# EAGLE design rpi2_relay2 (EAGLE 7.7.0)
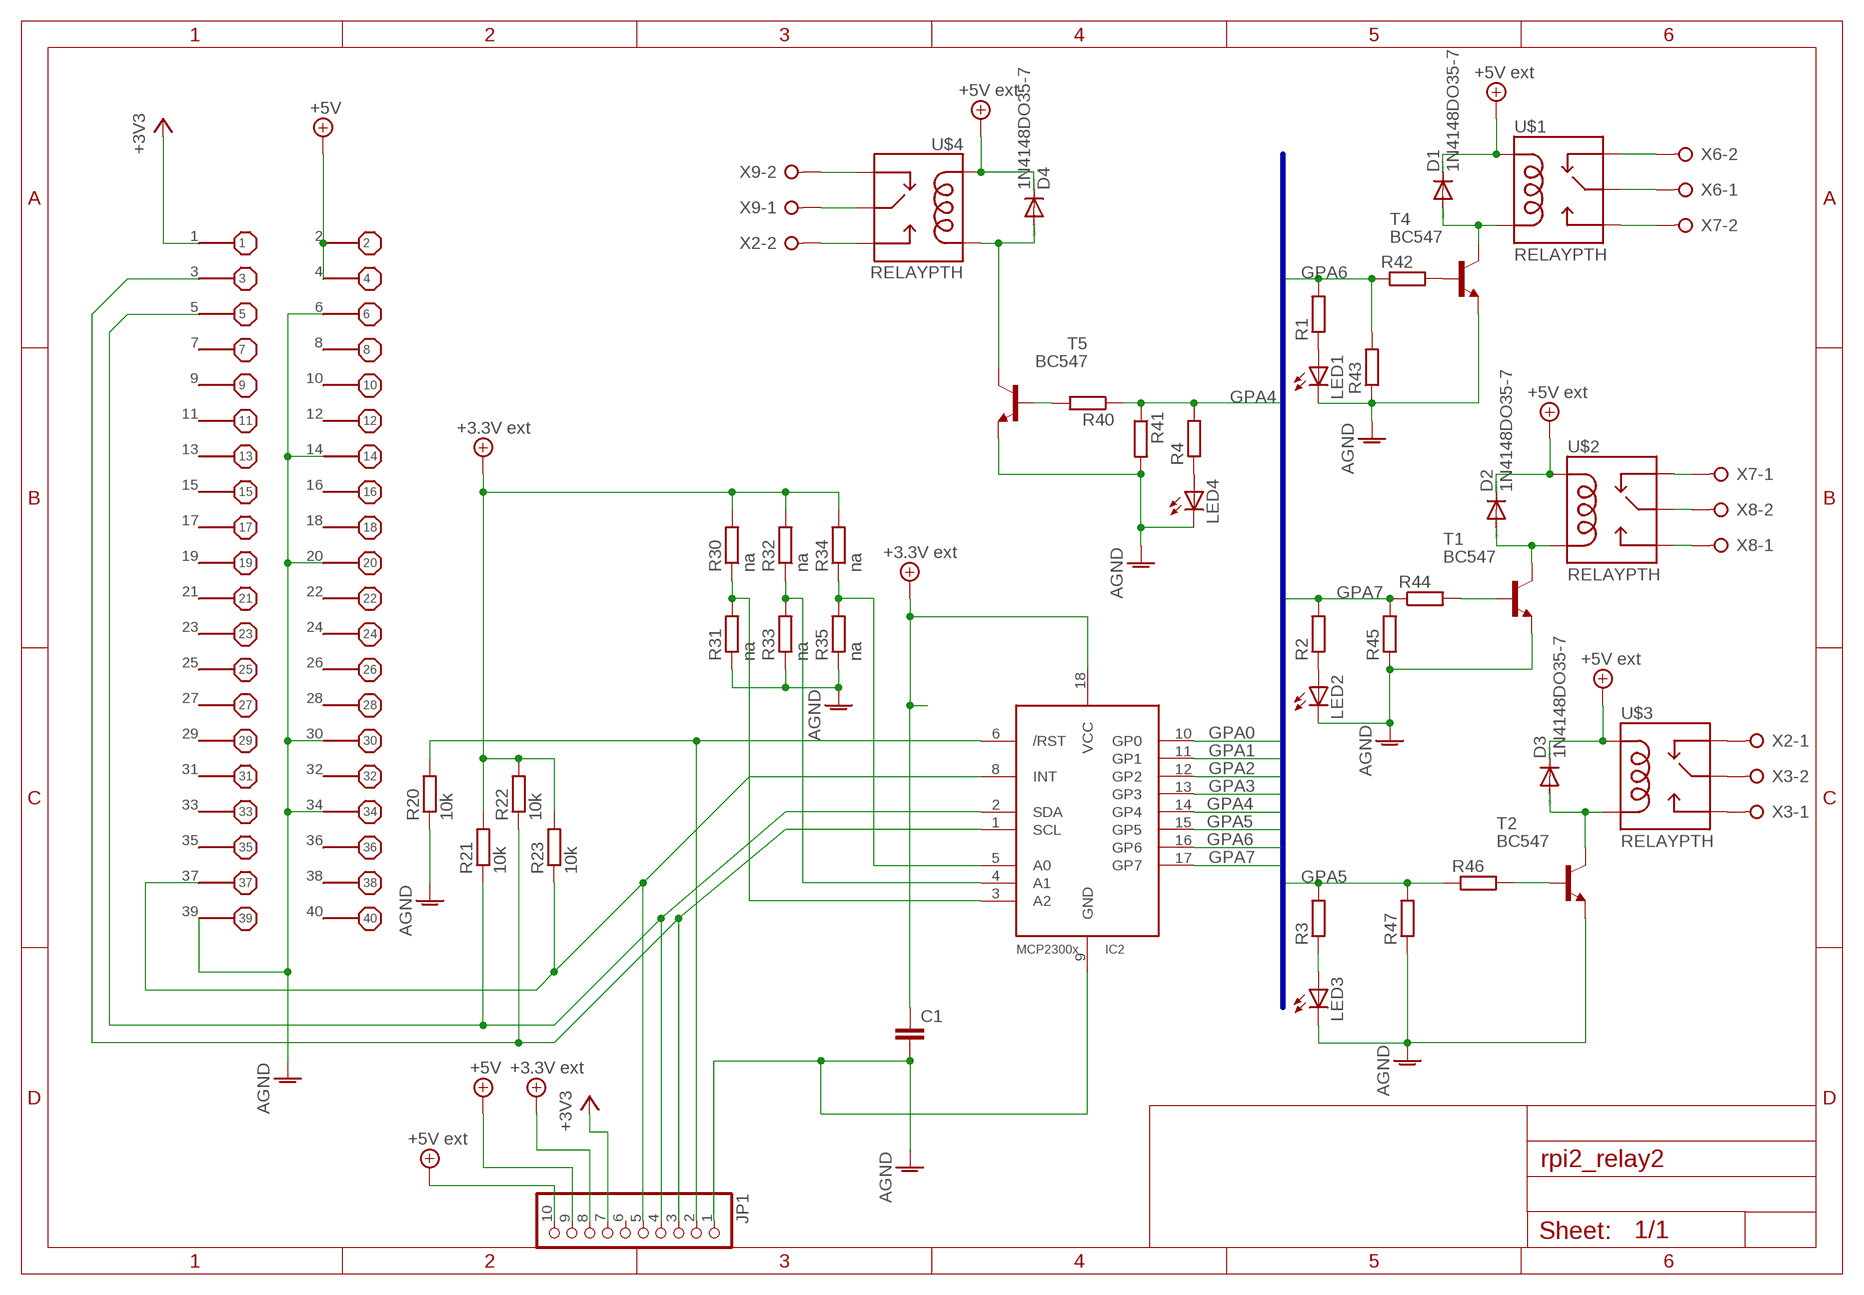
[diagram p0: schematic, sheet 1]

## Parts
C1  C-EUC1210  [C1210]
D1  1N4148DO35-7  [DO35-7]
D2  1N4148DO35-7  [DO35-7]
D3  1N4148DO35-7  [DO35-7]
D4  1N4148DO35-7  [DO35-7]
IC2  MCP23008/P  [DIL18]
JP1  PINHD-1X10  [1X10]
LED1  LEDCHIP-LED0805  [CHIP-LED0805]
LED2  LEDCHIP-LED0805  [CHIP-LED0805]
LED3  LEDCHIP-LED0805  [CHIP-LED0805]
LED4  LEDCHIP-LED0805  [CHIP-LED0805]
R1  R-EU_R0805  [R0805]
R2  R-EU_R0805  [R0805]
R3  R-EU_R0805  [R0805]
R4  R-EU_R0805  [R0805]
R20  10k  R-EU_R0805  [R0805]
R21  10k  R-EU_R0805  [R0805]
R22  10k  R-EU_R0805  [R0805]
R23  10k  R-EU_R0805  [R0805]
R30  na  R-EU_R0805  [R0805]
R31  na  R-EU_R0805  [R0805]
R32  na  R-EU_R0805  [R0805]
R33  na  R-EU_R0805  [R0805]
R34  na  R-EU_R0805  [R0805]
R35  na  R-EU_R0805  [R0805]
R40  R-EU_R0805  [R0805]
R41  R-EU_R0805  [R0805]
R42  R-EU_R0805  [R0805]
R43  R-EU_R0805  [R0805]
R44  R-EU_R0805  [R0805]
R45  R-EU_R0805  [R0805]
R46  R-EU_R0805  [R0805]
R47  R-EU_R0805  [R0805]
T1  BC547  [TO92]
T2  BC547  [TO92]
T4  BC547  [TO92]
T5  BC547  [TO92]
U$1  RELAYPTH  [SRD-05VDC-SL-C]
U$2  RELAYPTH  [SRD-05VDC-SL-C]
U$3  RELAYPTH  [SRD-05VDC-SL-C]
U$4  RELAYPTH  [SRD-05VDC-SL-C]
X1  B+_GPIO  [B+_GPIO]
X2  W237-02P  [W237-132]
X3  W237-02P  [W237-132]
X6  W237-02P  [W237-132]
X7  W237-02P  [W237-132]
X8  W237-02P  [W237-132]
X9  W237-02P  [W237-132]

## Nets
3.3VEXT: C1.1 IC2.18(VCC) JP1.8 R21.2 R22.2 R23.2 R30.2 R32.2 R34.2 ; supply symbol labelled +3.3V ext
+3V3: JP1.7 X1.1
+5V: JP1.9 X1.2 X1.4
+5V/1: D1.C D2.C D3.C D4.C JP1.10 U$1.COIL1 U$2.COIL1 U$3.COIL1 U$4.COIL1 ; supply symbol labelled +5V ext
AGND: C1.2 IC2.9(GND) JP1.1 LED1.C LED2.C LED3.C LED4.C R20.1 R31.1 R33.1 R35.1 R41.2 R43.1 R45.1 R47.1 T1.1(E) T2.1(E) T4.1(E) T5.1(E) X1.6 X1.14 X1.20 X1.30 X1.34 X1.39
GPA0: IC2.10(GP0)
GPA1: IC2.11(GP1)
GPA2: IC2.12(GP2)
GPA3: IC2.13(GP3)
GPA4: IC2.14(GP4) R4.2 R40.1 R41.1
GPA5: IC2.15(GP5) R3.2 R46.1 R47.2
GPA6: IC2.16(GP6) R1.2 R42.1 R43.2
GPA7: IC2.17(GP7) R2.2 R44.1 R45.2
N$1: R46.2 T2.2(B)
N$2: D1.A T4.3(C) U$1.COIL0
N$3: IC2.1(SCL) JP1.3 R22.1 X1.3
N$4: IC2.2(SDA) JP1.4 R21.1 X1.5
N$5: LED1.A R1.1
N$6: IC2.8(INT) JP1.5 R23.1 X1.37
N$7: IC2.6(/RST) JP1.2 R20.2
N$8: R44.2 T1.2(B)
N$9: U$1.SWCOMMON X6.1
N$10: U$1.SWCLOSED(SWCLOSE) X6.2
N$11: U$1.SWOPEN X7.2
N$12: D2.A T1.3(C) U$2.COIL0
N$13: LED2.A R2.1
N$14: U$2.SWCLOSED(SWCLOSE) X7.1
N$15: U$2.SWOPEN X8.1
N$16: U$2.SWCOMMON X8.2
N$17: D3.A T2.3(C) U$3.COIL0
N$18: LED3.A R3.1
N$19: U$3.SWCOMMON X3.2
N$20: U$3.SWOPEN X3.1
N$21: U$3.SWCLOSED(SWCLOSE) X2.1
N$22: D4.A T5.3(C) U$4.COIL0
N$23: IC2.3(A2) R30.1 R31.2
N$24: U$4.SWCOMMON X9.1
N$25: U$4.SWOPEN X2.2
N$26: U$4.SWCLOSED(SWCLOSE) X9.2
N$27: R40.2 T5.2(B)
N$28: R42.2 T4.2(B)
N$29: IC2.4(A1) R32.1 R33.2
N$30: IC2.5(A0) R34.1 R35.2
N$31: LED4.A R4.1
Unconnected: JP1.6 X1.7 X1.8 X1.9 X1.10 X1.11 X1.12 X1.13 X1.15 X1.16 X1.17 X1.18 X1.19 X1.21 X1.22 X1.23 X1.24 X1.25 X1.26 X1.27 X1.28 X1.29 X1.31 X1.32 X1.33 X1.35 X1.36 X1.38 X1.40

## Buses
GPA[0..7],GPB[0..7]

## Library data of the parts
C1 = rcl:C-EU: CAPACITOR, European symbol
D1-D4 = diode:1N4148: DIODE high speed (Philips)
IC2 = adafruit:MCP23008: MCP23008 Inexpensive i2c i/o expander - 8 general purpose i/o pins with optional pullups
JP1 = pinhead:PINHD-1X10: PIN HEADER
LED1-LED4 = led:LED: LED OSRAM: - CHIPLED LG R971, LG N971, LY N971, LG Q971, LY Q971, LO R971, LY R971 LH N974, LH R974 LS Q976, LO Q976, LY Q976 LO Q996 - Hyper CHIPLED LW Q18S LB Q993, LB Q99A, LB R99A - SideLED LS A670, LO A670, LY A670, LG A670, LP A670 LB A673, LV A673, LT A673, LW A673 LH A674 LY A675 LS A676, LA A676, LO A676, LY A676, LW A676 LS A679, LY A679, LG A679 - Hyper Micro SIDELED® LS Y876, LA Y876, LO Y876, LY Y876 LT Y87S - SmartLED LW L88C, LW L88S LB L89C, LB L89S, LG L890 LS L89K, LO L89K, LY L89K LS L896, LA L896, LO L896, LY L896 - TOPLED LS T670, LO T670, LY T670, LG T670, LP T670 LSG T670, LSP T670, LSY T670, LOP T670, LYG T670 LG T671, LOG T671, LSG T671 LB T673, LV T673, LT T673, LW T673 LH T674 LS T676, LA T676, LO T676, LY T676, LB T676, LH T676, LSB T676, LW T676 LB T67C, LV T67C, LT T67C, LS T67K, LO T67K, LY T67K, LW E67C LS E67B, LA E67B, LO E67B, LY E67B, LB E67C, LV E67C, LT E67C LW T67C LS T679, LY T679, LG T679 LS T770, LO T770, LY T770, LG T770, LP T770 LB T773, LV T773, LT T773, LW T773 LH T774 LS E675, LA E675, LY E675, LS T675 LS T776, LA T776, LO T776, LY T776, LB T776 LHGB T686 LT T68C, LB T68C - Hyper Mini TOPLED® LB M676 - Mini TOPLED Santana® LG M470 LS M47K, LO M47K, LY M47K Source: http://www.osram.convergy.de LUXEON: - LUMILED® LXK2-PW12-R00, LXK2-PW12-S00, LXK2-PW14-U00, LXK2-PW14-V00 LXK2-PM12-R00, LXK2-PM12-S00, LXK2-PM14-U00 LXK2-PE12-Q00, LXK2-PE12-R00, LXK2-PE12-S00, LXK2-PE14-T00, LXK2-PE14-U00 LXK2-PB12-K00, LXK2-PB12-L00, LXK2-PB12-M00, LXK2-PB14-N00, LXK2-PB14-P00, LXK2-PB14-Q00 LXK2-PR12-L00, LXK2-PR12-M00, LXK2-PR14-Q00, LXK2-PR14-R00 LXK2-PD12-Q00, LXK2-PD12-R00, LXK2-PD12-S00 LXK2-PH12-R00, LXK2-PH12-S00 LXK2-PL12-P00, LXK2-PL12-Q00, LXK2-PL12-R00 Source: www.luxeon.com KINGBRIGHT: KA-3528ASYC Source: www.kingbright.com
R1-R4 R20-R23 R30-R35 R40-R47 = rcl:R-EU_: RESISTOR, European symbol
T1 T2 T4 T5 = transistor:BC547: NPN TRANSISTOR
U$1-U$4 = SRD-05VDC-SL-C:RELAY: SPDT relay (COM-00101)
X1 = raspberry:B+_GPIO
X2 X3 X6-X9 = con-wago-508:W237-02P: WAGO SREW CLAMP; OC_FARNELL: unknown; OC_NEWARK: unknown

## Board
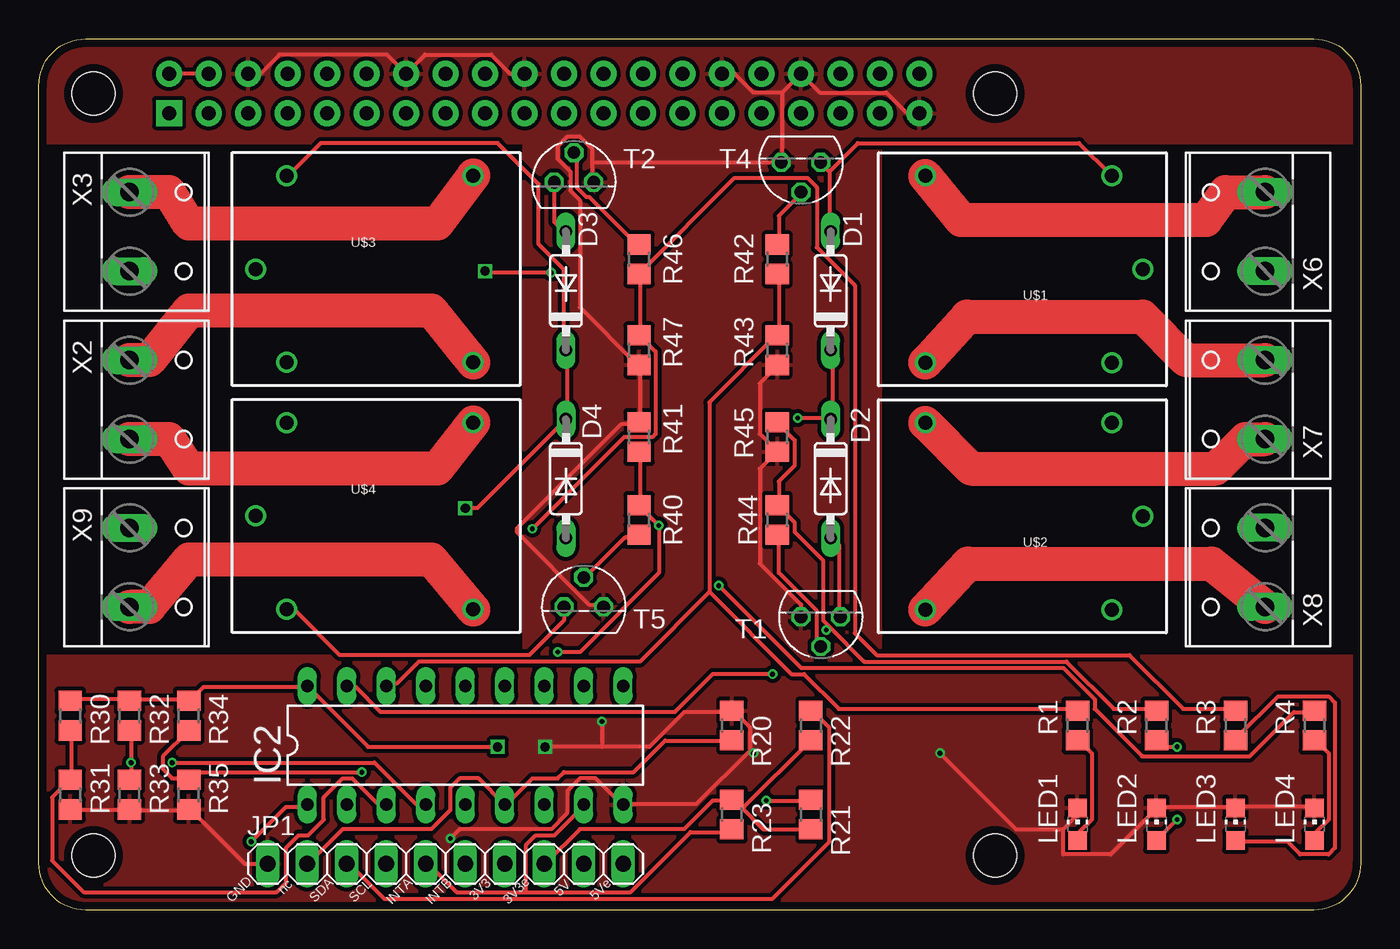
[diagram p1: board, top side]
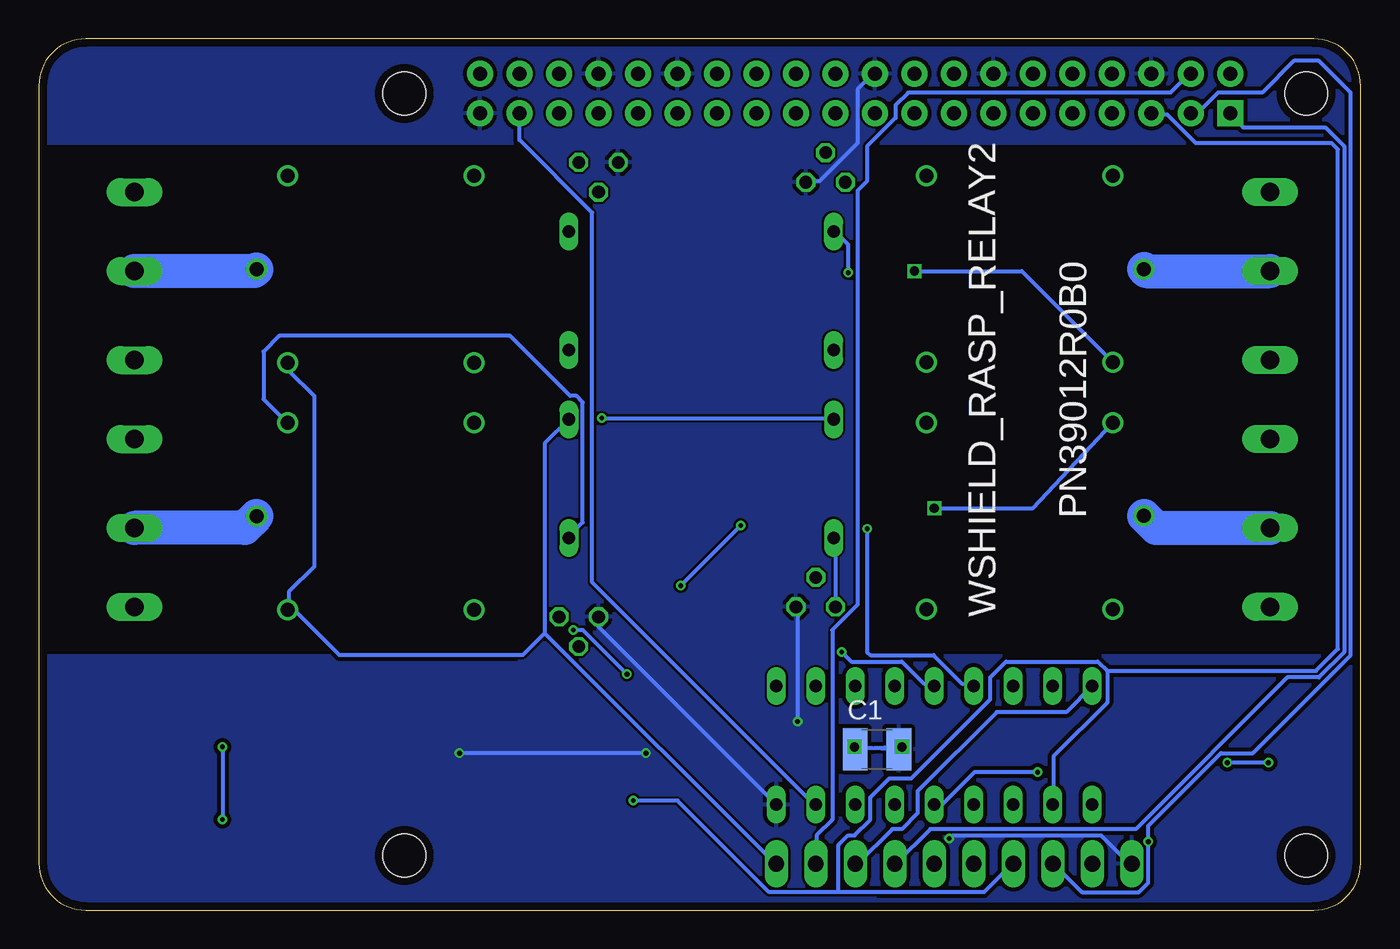
[diagram p2: board, bottom side, seen from below]

Size 85 x 56 mm. Coordinates in mm from the lower left corner, seen from the top.
Outline: 0,53 arc-90 3,56 82,56 arc-90 85,53 85,3 arc-90 82,0 3,0 arc-90 0,3 0,53
Copper layers (1*16): Top 0.035mm / dielectric 1.6mm / Bottom 0.035mm
Design rules "Elecrow_2-layer_PCB_eagle_rule *": minimum track width 10mil, minimum drill 12mil, track to track 6mil, track to pad 6mil, pad to pad 6mil, via to via 8mil, smd to smd 0mil, copper to edge 20mil, drill to drill 10mil, minimum pad ring 6mil, minimum via ring 6mil, stop-mask expansion 0mil, vias tented up to drill 100mil, thermal gap 10mil
Holes 2.75 mm at 3.5,52.5 3.5,3.5 61.5,52.5 61.5,3.5

### Footprints (pad centres in the part's own frame; a part is rotated, then mirrored left to right if it is on the bottom)
C1210 = smd 1.6 x 2.7: 1 -1.4,0; 2 1.4,0
DO35-7 = drill 0.813 long: A 3.81,0; C -3.81,0
DIL18 = drill 0.813 long: 1 -10.16,-3.81; 2 -7.62,-3.81; 3 -5.08,-3.81; 4 -2.54,-3.81; 5 0,-3.81; 6 2.54,-3.81; 7 5.08,-3.81; 8 7.62,-3.81; 9 10.16,-3.81; 10 10.16,3.81; 11 7.62,3.81; 12 5.08,3.81; 13 2.54,3.81; 14 0,3.81; 15 -2.54,3.81; 16 -5.08,3.81; 17 -7.62,3.81; 18 -10.16,3.81
1X10 = drill 1.016 long: 1 -11.43,0; 2 -8.89,0; 3 -6.35,0; 4 -3.81,0; 5 -1.27,0; 6 1.27,0; 7 3.81,0; 8 6.35,0; 9 8.89,0; 10 11.43,0
CHIP-LED0805 = smd 1.2 x 1.2: A 0,-1.05; C 0,1.05
R0805 = smd 1.3 x 1.5: 1 -0.95,0; 2 0.95,0
TO92 = drill 0.813 octagon: 1 1.27,0; 2 0,1.905; 3 -1.27,0
SRD-05VDC-SL-C = drill 0.9: COIL0 -5.39,-6.12; COIL1 -5.39,5.88; SWCLOSED 6.61,-6.12; SWCOMMON -7.39,-0.12; SWOPEN 6.61,5.88
B+_GPIO = drill 0.9 pad 1.676 square: 1 -24.13,-1.27 | drill 0.9 pad 1.676: 2 -24.13,1.27; 3 -21.59,-1.27; 4 -21.59,1.27; 5 -19.05,-1.27; 6 -19.05,1.27; 7 -16.51,-1.27; 8 -16.51,1.27; 9 -13.97,-1.27; 10 -13.97,1.27; 11 -11.43,-1.27; 12 -11.43,1.27; 13 -8.89,-1.27; 14 -8.89,1.27; 15 -6.35,-1.27; 16 -6.35,1.27; 17 -3.81,-1.27; 18 -3.81,1.27; 19 -1.27,-1.27; 20 -1.27,1.27; 21 1.27,-1.27; 22 1.27,1.27; 23 3.81,-1.27; 24 3.81,1.27; 25 6.35,-1.27; 26 6.35,1.27; 27 8.89,-1.27; 28 8.89,1.27; 29 11.43,-1.27; 30 11.43,1.27; 31 13.97,-1.27; 32 13.97,1.27; 33 16.51,-1.27; 34 16.51,1.27; 35 19.05,-1.27; 36 19.05,1.27; 37 21.59,-1.27; 38 21.59,1.27; 39 24.13,-1.27; 40 24.13,1.27
W237-132 = drill 1.194 long: 1 -2.54,-0.635; 2 2.54,-0.635

### Placement (x,y rotation side)
C1  31.1,10.34 0 bottom
D1  50.91,39.8 90 top
D2  50.91,27.73 270 top
D3  33.9,39.8 90 top
D4  33.9,27.73 270 top
IC2  27.42,10.59 0 top
JP1  26.15,2.97 0 top
LED1  66.79,5.51 0 top
LED2  71.87,5.51 0 top
LED3  76.95,5.51 0 top
LED4  82.03,5.51 0 top
R1  66.79,11.86 90 top
R2  71.87,11.86 90 top
R3  76.95,11.86 90 top
R4  82.03,11.86 90 top
R20  44.56,11.86 270 top
R21  49.65,6.15 270 top
R22  49.65,11.86 270 top
R23  44.56,6.15 90 top
R30  2.02,12.5 90 top
R31  2.02,7.42 90 top
R32  5.83,12.5 90 top
R33  5.83,7.42 90 top
R34  9.64,12.5 90 top
R35  9.64,7.42 90 top
R40  38.6,25.07 270 top
R41  38.6,30.4 90 top
R42  47.49,41.83 90 top
R43  47.49,35.99 90 top
R44  47.49,25.07 270 top
R45  47.49,30.4 90 top
R46  38.6,41.83 90 top
R47  38.6,35.99 90 top
T1  50.28,18.84 180 top
T2  34.41,46.79 0 top
T4  49.01,48.05 180 top
T5  35.04,19.48 0 top
U$1  63.62,41.07 180 top
U$2  63.62,25.2 180 top
U$3  21.32,41.32 0 top
U$4  21.32,25.45 0 top
X1  32.5,52.5 0 top
X2  6.47,32.81 270 top
X3  6.47,43.61 270 top
X6  78.22,43.61 90 top
X7  78.22,32.81 90 top
X8  78.22,22.02 90 top
X9  6.47,22.02 270 top

### Tracks (layer width: path | path; a pad name or v marks a point on that pad's centre or on a via)
3.3VEXT  (via drill 0.6)
  Top 0.254: 45.15,6.63 44.74,7.03 R23.2 | 45.15,6.63 46.57,5.21 49.62,5.21 R21.2 | 45.15,6.63 45.35,6.63 49.62,10.9 R22.2 | 45.15,6.63 R23.2 | JP1.8 32.55,2.97 34.79,5.21 41.49,5.21 43.32,7.03 44.54,7.03 R23.2 | R30.2 2.07,13.54 5.73,13.54 R32.2 5.93,13.54 9.59,13.54 R34.2 9.79,13.54 10.61,14.35 17.11,14.35 IC2.18 21.17,10.49 v29.5,10.49
  Bottom 0.254: v29.5,10.49 C1.1 | IC2.18 18.94,12.72 23.41,12.72 28.49,7.64 28.49,6.22 29.5,5.21 30.11,5.21 32.35,2.97 JP1.8
+3V3
  Bottom 0.254: JP1.7 29.91,2.97 27.67,5.21 14.47,5.21 4.71,14.96 2.68,14.96 1.06,16.58 1.06,49.1 2.27,50.32 7.56,50.32 8.37,51.13 X1.1
+5V
  Top 0.254: X1.4 X1.2
  Bottom 0.254: JP1.9 34.99,2.97 34.99,4.8 33.97,5.81 33.97,18.01 32.35,19.63 32.35,46.25 31.74,46.86 31.74,49.1 29.91,50.92 29.91,51.74 29.1,52.55 12.23,52.55 11.01,53.77 X1.4
+5V/1  (via drill 0.3, 0.6)
  Top 0.254: U$3.COIL1 16.09,47.27 18.12,49.3 29.5,49.3 32.14,46.66 32.14,42.8 33.77,41.17 33.77,36.09 D3.C 33.97,35.89 33.97,31.62 D4.C 28.18,25.83 v27.42,25.83 | D1.C 51.04,35.89 51.04,31.62 D2.C 50.84,31.62 v48.81,31.62
  Bottom 0.254: U$1.COIL1 68.92,35.08 68.92,34.67 67.3,33.04 67.3,22.07 68.92,20.45 68.92,19.43 U$2.COIL1 68.92,19.23 68.52,19.23 65.67,16.38 53.89,16.38 52.46,17.8 | 52.46,17.8 37.63,2.97 JP1.10 | 52.46,17.8 52.46,30 D2.C | v48.81,31.62 33.97,31.62 D4.C | v27.42,25.83 21.07,25.83 U$4.COIL1
AGND  (via drill 0.3, 0.6)
  Top 0.254: R43.1 47.38,34.87 46.37,33.86 46.37,30.61 47.38,29.59 R45.1 47.38,29.39 46.37,28.37 46.37,22.27 49.01,19.63 T1.1 | R31.1 2.07,6.42 5.73,6.42 R33.1 5.93,6.42 9.59,6.42 R35.1 9.79,6.42 13.25,2.97 JP1.1 | 45.76,10.29 45.76,11.71 44.74,12.72 R20.1 44.54,12.72 41.49,12.72 39.26,10.49 36.21,10.49 | 45.76,10.29 42.3,6.83 37.63,6.83 IC2.9 37.43,6.83 35.8,8.46 34.79,8.46 33.97,7.64 33.97,6.22 32.96,5.21 27.06,5.21 v26.46,4.6 | 36.21,10.49 v32.55,10.49 | 47.79,52.55 47.79,48.08 T4.1 47.59,48.08 35.6,48.08 | 47.79,52.55 X1.34 50.23,52.55 54.5,52.55 55.72,51.33 56.53,51.33 X1.39 | X1.30 44.74,53.77 45.96,52.55 47.79,52.55 | T5.1 36.21,19.63 35.4,19.63 30.72,24.31 30.72,24.51 37.43,31.22 38.44,31.22 R41.2 38.65,31.42 38.65,34.87 R47.1 38.44,35.08 34.79,38.73 34.79,45.64 34.18,46.25 34.18,47.47 33.36,48.28 33.36,49.1 33.97,49.71 34.79,49.71 35.6,48.89 35.6,48.08 | X1.6 14.26,53.77 15.48,54.99 22.39,54.99 X1.14 24.83,54.99 29.1,54.99 30.32,53.77 X1.20 | 35.6,48.08 35.6,46.86 T2.1 | v36.21,12.11 36.21,10.49 | LED4.C 81.93,6.63 77.05,6.63 LED3.C 76.85,6.63 71.97,6.63 LED2.C 71.77,6.42 68.92,3.58 65.88,3.58 65.88,5.21 | 65.88,5.21 66.69,6.02 66.69,6.42 LED1.C | 65.88,5.21 62.83,5.21 v57.95,10.08 | 45.76,10.29 v45.96,10.08
  Bottom 0.254: v32.55,10.49 C1.2 | v26.46,4.6 26.25,4.8 16.7,4.8 14.87,2.97 JP1.1 | T1.1 49.01,18.21 IC2.9 | T2.1 35.6,46.86 34.79,46.86 32.35,49.3 32.35,52.75 31.33,53.77 X1.20 | v36.21,12.11 36.21,19.43 T5.1 | v45.96,10.08 v57.95,10.08
  pour Bottom (isolate 0.254): 0.11,49.33 0.11,53.13 arc-90 3.29,56.31 3.92,56.31 82.03,56.31 arc-90 85.2,53.13 85.2,49.33
  pour Top (isolate 0.254): 0.11,49.33 0.11,53.13 arc-90 3.29,56.31 3.92,56.31 82.03,56.31 arc-90 85.2,53.13 85.2,52.5 85.2,49.33
  pour Top (isolate 0.254): 85.2,16.3 85.2,2.97 arc-90 82.03,-0.2 81.39,-0.2 3.29,-0.2 arc-90 0.11,2.97 0.11,16.3
  pour Bottom (isolate 0.254): 85.2,16.3 85.2,2.97 arc-90 82.03,-0.2 81.39,-0.2 3.29,-0.2 arc-90 0.11,2.97 0.11,16.3
  pour Bottom: 31.23,49.96 31.23,56.31 54.09,56.31 54.09,-0.2 31.87,-0.2 31.23,-0.2
  pour Top (isolate 0.254): 31.23,56.31 54.09,56.31 54.09,-0.2 31.23,-0.2
GPA4  (via drill 0.3)
  Top 0.254: R41.1 38.65,29.39 38.65,26.14 R40.1 38.65,25.93 v39.87,24.71 39.87,21.66 34.79,16.58 v33.36,16.58 | v43.73,20.85 49.01,15.57 65.88,15.57 67.91,13.54 67.91,12.93 70.96,9.88 77.86,9.88 80.71,12.72 81.93,12.72 R4.2
  Bottom 0.254: v39.87,24.71 v43.73,20.85 | v33.36,16.58 32.75,15.98 29.5,15.98 28.08,14.55 27.47,14.55 IC2.14
GPA5  (via drill 0.3)
  Top 0.254: R3.2 76.85,12.93 73.6,12.93 70.14,16.38 53.89,16.38 52.46,17.8 52.46,40.16 50.03,42.59 50.03,46.45 49.42,47.06 44.74,47.06 38.65,40.97 R46.1 38.65,40.77 38.65,37.11 R47.2 38.65,36.9 39.66,35.89 39.66,30.61 39.46,30.4 37.63,30.4 v31.74,24.51
  Bottom 0.254: v31.74,24.51 31.74,16.58 31.54,16.38 27.47,16.38 25.64,14.55 25.03,14.55 IC2.15
GPA6
  Top 0.254: R42.1 47.59,40.77 47.59,37.11 R43.2 47.38,36.9 43.12,32.64 43.12,20.45 | 43.12,20.45 48.4,15.16 49.21,15.16 51.45,12.93 66.69,12.93 R1.2 | 43.12,20.45 38.65,15.98 24.42,15.98 23,14.55 22.39,14.55 IC2.16
GPA7  (via drill 0.3)
  Top 0.254: R45.2 47.59,31.22 48.6,30.2 48.6,28.57 47.59,27.56 47.59,26.14 R44.1 47.59,25.93 48.6,24.92 48.6,24.31 50.43,22.48 50.43,18.62 50.84,18.21 | 50.84,18.21 53.07,15.98 66.08,15.98 69.13,12.93 71.77,12.93 R2.2 | v47.18,15.16 43.32,15.16 40.88,12.72 21.98,12.72 20.36,14.35 19.95,14.35 IC2.17 | 50.84,18.21 v50.64,18.01
  Bottom 0.254: v47.18,15.16 50.03,18.01 v50.64,18.01
N$1
  Top 0.254: R46.2 38.44,42.8 35.4,45.84 35.19,45.84 34.58,46.45 34.58,48.69 T2.2
N$2
  Top 0.254: 50.84,47.47 50.84,43.61 D1.A | 50.84,47.47 50.43,47.88 T4.3 | 50.84,47.47 52.67,49.3 66.89,49.3 68.92,47.27 U$1.COIL0
N$3  (via drill 0.3)
  Top 0.254: R22.1 49.82,12.72 50.84,11.71 50.84,4.39 47.18,0.74 22.19,0.74 19.95,2.97 JP1.3 | v13.65,4.39 15.89,6.63 17.11,6.63 IC2.1
  Bottom 0.254: JP1.3 19.75,2.97 17.92,1.14 14.26,1.14 13.65,1.75 v13.65,4.39 13.65,5.41 8.98,10.08 6.95,10.08 0.65,16.38 0.65,52.55 2.68,54.58 4.31,54.58 6.34,52.55 9.18,52.55 10.4,51.33 10.81,51.33 X1.3
N$4  (via drill 0.3)
  Top 0.254: v46.77,7.03 49.62,7.03 R21.1
  Bottom 0.254: v46.77,7.03 43.93,7.03 38.04,1.14 33.57,1.14 | 33.57,1.14 24.22,1.14 22.39,2.97 JP1.4 | 16.3,15.37 16.3,13.33 19.75,9.88 19.75,6.83 IC2.2 | 16.3,15.37 16.9,15.98 22.8,15.98 23.81,14.96 23.81,13.54 28.89,8.46 30.32,8.46 31.54,7.24 31.54,5.81 32.55,4.8 32.96,4.8 33.57,4.19 33.57,1.14 | 16.3,15.37 2.88,15.37 1.46,16.79 1.46,48.89 1.87,49.3 10.61,49.3 12.43,51.13 13.45,51.13 X1.5
N$5
  Top 0.254: LED1.A 66.89,4.6 66.89,5 67.7,5.81 67.7,10.08 66.89,10.9 R1.1
N$6
  Top 0.254: 31.33,1.14 26.86,1.14 25.03,2.97 JP1.5 | 31.33,1.14 38.04,1.14 41.9,5 44.54,5 R23.1 | 31.33,1.14 31.33,4.19 31.94,4.8 33.16,4.8 34.99,6.63 IC2.8
  Bottom 0.254: X1.37 54.09,49.5 49.42,44.83 49.42,21.05 35.19,6.83 IC2.8
N$7
  Top 0.254: R20.2 44.54,10.9 40.27,10.9 38.24,8.86 33.77,8.86 33.36,8.46 31.74,8.46 30.11,6.83 IC2.6 28.28,8.46 27.06,8.46 26.46,7.85 26.46,6.42 25.24,5.21 19.55,5.21 17.31,2.97 JP1.2
N$8
  Top 0.254: T1.2 50.03,17.19 50.03,19.23 47.59,21.66 47.59,24.1 R44.2
N$9
  Bottom 2.184: U$1.SWCOMMON 71.12,41.07 X6.1
N$10
  Top 2.184: U$1.SWCLOSED 59.31,44.37 75.04,44.37 76.31,46.15 X6.2
N$11
  Top 2.184: U$1.SWOPEN 59.71,38.15 70.98,38.15 73.77,35.36 X7.2
N$12
  Top 0.254: T1.3 51.45,19.02 51.45,23.49 51.04,23.9 D2.A
  Bottom 0.254: U$2.COIL0 69.13,31.42 70.55,32.84 70.55,35.89 69.53,36.9 54.7,36.9 50.84,33.04 50.43,33.04 50.03,32.64 50.03,24.92 50.84,24.1 D2.A
N$13  (via drill 0.3)
  Top 0.254: v73.19,5.81 71.97,4.6 LED2.A | v73.19,10.49 72.38,10.49 71.97,10.9 R2.1
  Bottom 0.254: v73.19,10.49 v73.19,5.81
N$14
  Top 2.184: U$2.SWCLOSED 59.95,28.37 75.68,28.37 77.58,30.27 X7.1
N$15
  Top 2.184: U$2.SWOPEN 59.76,22.27 75.43,22.27 X8.1
N$16
  Bottom 2.184: U$2.SWCOMMON 71.76,24.56 X8.2
N$17  (via drill 0.3, 0.6)
  Top 0.254: T2.3 33.16,46.66 33.16,44.22 33.77,43.61 D3.A | v32.96,40.97 28.79,40.97 v28.69,41.07
  Bottom 0.254: v32.96,40.97 32.96,42.8 33.77,43.61 D3.A | v28.69,41.07 21.8,41.07 U$3.COIL0
N$18
  Top 0.254: LED3.A 77.05,4.39 80.3,4.39 81.12,3.58 82.94,3.58 83.35,3.99 83.35,13.33 82.94,13.74 79.69,13.74 77.05,11.1 R3.1
N$19
  Bottom 2.184: U$3.SWCOMMON 13.8,41.07 X3.2
N$20
  Top 2.184: U$3.SWOPEN 25.61,44.12 9.64,44.12 8.37,46.15 X3.1
N$21
  Top 2.184: U$3.SWCLOSED 25.24,38.53 9.64,38.53 7.1,35.36 X2.1
N$22
  Top 0.254: T5.3 33.77,18.62 31.54,16.38 19.34,16.38 16.5,19.23 16.09,19.23 U$4.COIL0
  Bottom 0.254: 33.77,23.93 D4.A 33.77,23.9 T5.3
N$23
  Top 0.254: R30.1 2.07,11.5 2.07,8.46 R31.2 1.87,8.25 0.85,7.24 0.85,3.17 2.88,1.14 15.28,1.14 15.89,1.75 15.89,3.99 16.7,4.8 17.31,4.8 18.33,5.81 18.33,7.24 19.55,8.46 20.16,8.46 21.78,6.83 22.19,6.83 IC2.3
N$24
  Bottom 2.184: U$4.SWCOMMON 13.16,24.56 X9.1
N$25
  Top 2.184: U$4.SWOPEN 25.61,28.37 9.64,28.37 8.37,30.27 X2.2
N$26
  Top 2.184: U$4.SWCLOSED 25.24,22.53 9.64,22.53 7.1,19.48 X9.2
N$27
  Top 0.254: 37.76,23.95 37.63,23.9 35.19,21.46 T5.2
  Top 0.305: 37.76,23.95 38.44,23.95 R40.2
N$28
  Top 0.254: R42.2 47.59,42.8 47.59,44.63 49.01,46.05 T4.2
N$29  (via drill 0.3)
  Top 0.254: R33.2 5.93,8.46 v5.93,9.47 5.93,11.5 R32.1 | v8.57,9.47 21.58,9.47 24.22,6.83 24.83,6.83 IC2.4
  Bottom 0.254: v5.93,9.47 v8.57,9.47
N$30  (via drill 0.3)
  Top 0.254: R34.1 9.59,11.5 7.96,9.88 7.96,9.07 8.57,8.46 9.59,8.46 R35.2 9.79,8.46 10.2,8.86 v20.77,8.86
  Bottom 0.254: v20.77,8.86 24.83,8.86 26.86,6.83 27.27,6.83 IC2.5
N$31
  Top 0.254: LED4.A 82.13,4.6 82.13,5 82.94,5.81 82.94,10.08 82.13,10.9 R4.1

### Text on the board
tNames: GND | nc | SDA | SCL | 3V3 | 5V | 5Ve | INTA | INTB | 3V3e
bNames: PN39012R0B0 | WSHIELD_RASP_RELAY2